# EAGLE schematic DetecteurSonnore (EAGLE 7.7.0)
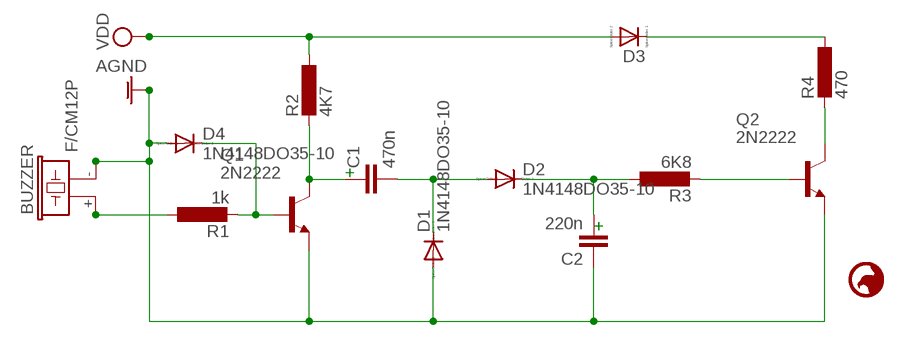
[diagram p0: schematic, sheet 1]

## Parts
BUZZER  F/CM12P  [F/CM12P]
C1  470n  C7.5/3  [C7.5B3]
C2  220n  C7.5/3  [C7.5B3]
D1  1N4148DO35-10  [DO35-10]
D2  1N4148DO35-10  [DO35-10]
D3  DIODE_E-DO35-7  [DIODE_DO35-7]
D4  1N4148DO35-10  [DO35-10]
Q1  2N2222  [TO18]
Q2  2N2222  [TO18]
R1  1k  L-EU0207/15  [0207/15]
R2  4K7  L-EU0207/15  [0207/15]
R3  6K8  L-EU0207/15  [0207/15]
R4  470  L-EU0207/15  [0207/15]

## Nets
AGND: BUZZER.- C2.1 D1.A D4.A Q1.1(E) Q2.1(E)
N$1: BUZZER.+ R1.1
N$2: D3.C(A) R4.1
N$3: Q2.3(C) R4.2
N$4: Q2.2(B) R3.2
N$5: C2.2 D2.C R3.1
N$6: C1.2 D1.C D2.A
N$7: C1.1 Q1.3(C) R2.2
N$8: D4.C Q1.2(B) R1.2
VDD: D3.A(C) R2.1

## Notes on the sheet
- +
- +

## Library data of the parts
BUZZER = buzzer:F/CM12P: BUZZER Source: Buerklin; OC_FARNELL: unknown; OC_NEWARK: unknown
C1 C2 = capacitor-wima:C: CAPACITOR naming: grid - package width
D1 D2 D4 = diode:1N4148: DIODE high speed (Philips)
D3 = eagle-ltspice:DIODE_E-: Schottky Diode; SPICEMODEL: diode; SPICEPREFIX: D
Q1 Q2 = transistor:2N2222: NPN TRANSISTOR
R1-R4 = resistor:L-EU: INDUCTOR, European symbol